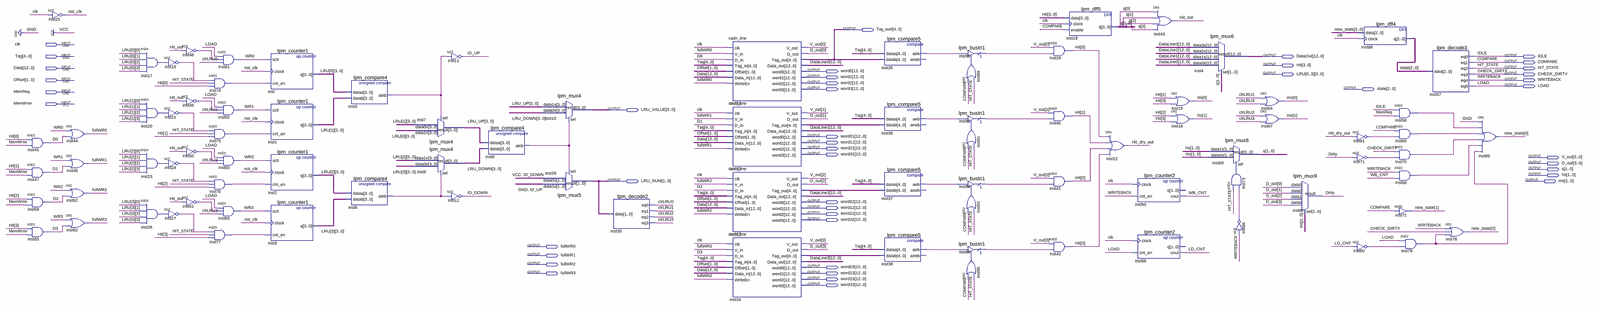
[diagram p0: schematic sheet, whole]
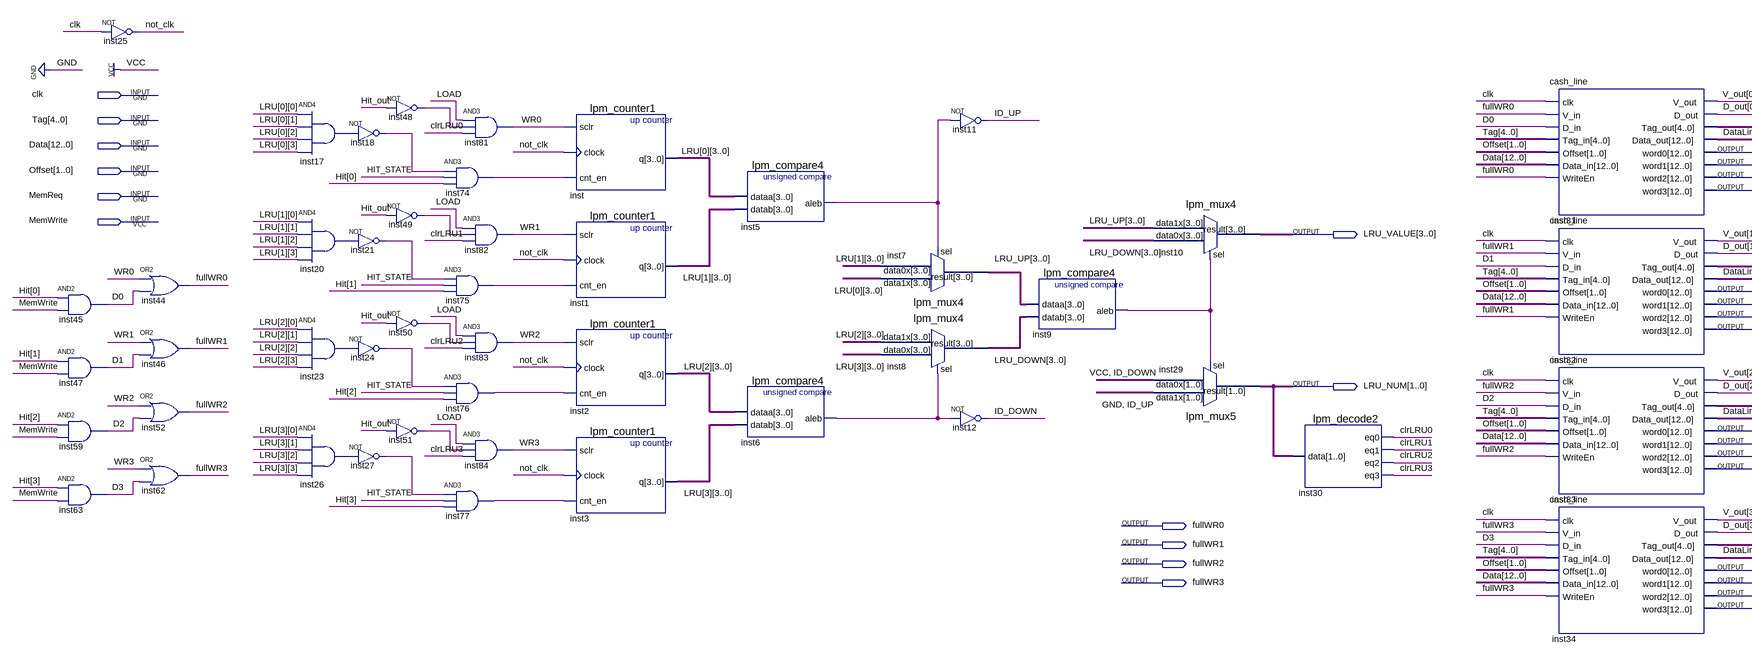
[diagram p1: schematic sheet, left part]
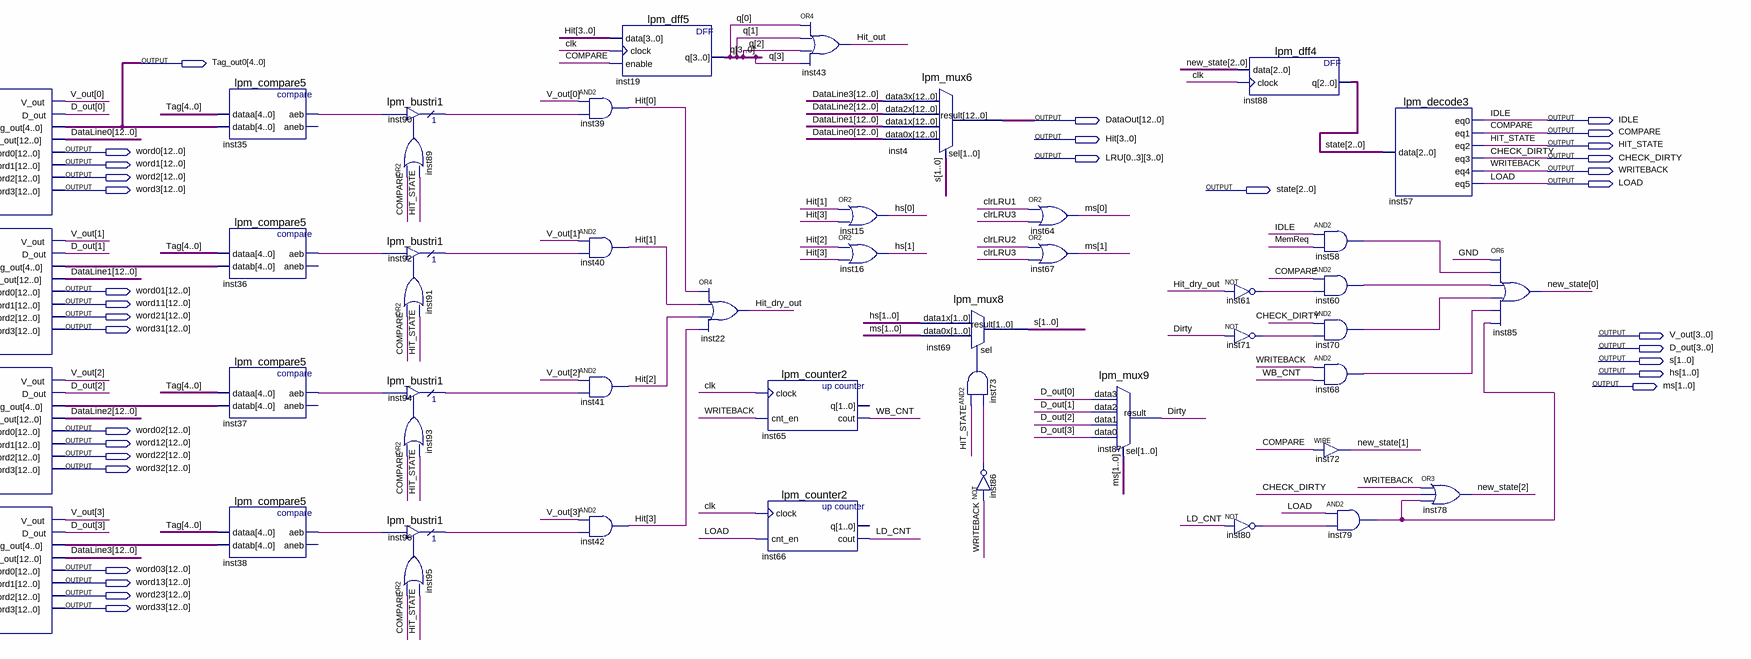
[diagram p2: schematic sheet, right part]
// Quartus schematic LRU_set.bdf as structural Verilog: 90 symbols, 44 pins
module LRU_set (
  input  clk,
  input  [4:0] Tag,
  input  [12:0] Data,
  input  [1:0] Offset,
  input  MemReq,
  input  MemWrite,
  output [4:0] Tag_out0,
  output [12:0] DataOut,
  output IDLE,
  output COMPARE,
  output [3:0] Hit,
  output HIT_STATE,
  output [12:0] word0,
  output [3:0] LRU_0,
  output [3:0] LRU_1,
  output [3:0] LRU_2,
  output [3:0] LRU_3,
  output CHECK_DIRTY,
  output [12:0] word1,
  output WRITEBACK,
  output [12:0] word2,
  output LOAD,
  output [12:0] word3,
  output [2:0] state,
  output [3:0] LRU_VALUE,
  output [12:0] word01,
  output [12:0] word11,
  output [12:0] word21,
  output [12:0] word31,
  output [3:0] V_out,
  output [3:0] D_out,
  output [1:0] s,
  output [1:0] hs,
  output [1:0] LRU_NUM,
  output [1:0] ms,
  output [12:0] word02,
  output [12:0] word12,
  output [12:0] word22,
  output [12:0] word32,
  output fullWR0,
  output fullWR1,
  output fullWR2,
  output [12:0] word03,
  output fullWR3,
  output [12:0] word13,
  output [12:0] word23,
  output [12:0] word33
);

  wire clrLRU0, clrLRU1, clrLRU2, clrLRU3, D0, D1, D2, D3, Dirty, Hit_dry_out, Hit_out, ID_DOWN, ID_UP,
       inst5_aleb, inst6_aleb, inst9_aleb, inst17_out, inst18_out, inst20_out, inst21_out, inst23_out,
       inst24_out, inst26_out, inst27_out, inst35_aeb, inst36_aeb, inst37_aeb, inst38_aeb, inst48_out,
       inst49_out, inst50_out, inst51_out, inst58_out, inst60_out, inst61_out, inst68_out, inst70_out,
       inst71_out, inst73_out, inst74_out, inst75_out, inst76_out, inst77_out, inst79_out, inst80_out,
       inst86_out, inst89_out, inst90_tridata, inst91_out, inst92_tridata, inst93_out, inst94_tridata,
       inst95_out, inst96_tridata, LD_CNT, not_clk, WB_CNT, WR0, WR1, WR2, WR3;
  wire [2:0] new_state;
  wire [3:0] LRU_DOWN, LRU_UP, q;
  wire [4:0] inst32_tag_out, inst33_tag_out, inst34_tag_out;
  wire [12:0] DataLine0, DataLine1, DataLine2, DataLine3;

  and inst45 (D0, Hit[0], MemWrite);
  and inst47 (D1, Hit[1], MemWrite);
  and inst59 (D2, Hit[2], MemWrite);
  and inst63 (D3, Hit[3], MemWrite);
  not inst25 (not_clk, clk);
  or inst44 (fullWR0, WR0, D0);
  or inst46 (fullWR1, WR1, D1);
  or inst52 (fullWR2, WR2, D2);
  or inst62 (fullWR3, WR3, D3);
  and inst17 (inst17_out, LRU_0[0], LRU_0[1], LRU_0[2], LRU_0[3]);
  and inst20 (inst20_out, LRU_1[0], LRU_1[1], LRU_1[2], LRU_1[3]);
  and inst23 (inst23_out, LRU_2[0], LRU_2[1], LRU_2[2], LRU_2[3]);
  and inst26 (inst26_out, LRU_3[0], LRU_3[1], LRU_3[2], LRU_3[3]);
  not inst18 (inst18_out, inst17_out);
  not inst21 (inst21_out, inst20_out);
  not inst24 (inst24_out, inst23_out);
  not inst27 (inst27_out, inst26_out);
  not inst48 (inst48_out, Hit_out);
  not inst49 (inst49_out, Hit_out);
  not inst50 (inst50_out, Hit_out);
  not inst51 (inst51_out, Hit_out);
  and inst81 (WR0, LOAD, inst48_out, clrLRU0);
  and inst74 (inst74_out, inst18_out, HIT_STATE, Hit[0]);
  and inst82 (WR1, LOAD, inst49_out, clrLRU1);
  and inst75 (inst75_out, inst21_out, HIT_STATE, Hit[1]);
  and inst83 (WR2, LOAD, inst50_out, clrLRU2);
  and inst76 (inst76_out, inst24_out, HIT_STATE, Hit[2]);
  and inst84 (WR3, LOAD, inst51_out, clrLRU3);
  and inst77 (inst77_out, inst27_out, HIT_STATE, Hit[3]);
  lpm_counter1 inst (.sclr(WR0), .clock(not_clk), .cnt_en(inst74_out), .q(LRU_0));
  lpm_counter1 inst1 (.sclr(WR1), .clock(not_clk), .cnt_en(inst75_out), .q(LRU_1));
  lpm_counter1 inst2 (.sclr(WR2), .clock(not_clk), .cnt_en(inst76_out), .q(LRU_2));
  lpm_counter1 inst3 (.sclr(WR3), .clock(not_clk), .cnt_en(inst77_out), .q(LRU_3));
  lpm_compare4 inst5 (.dataa(LRU_0), .datab(LRU_1), .aleb(inst5_aleb));
  lpm_compare4 inst6 (.dataa(LRU_2), .datab(LRU_3), .aleb(inst6_aleb));
  lpm_mux4 inst7 (.data1x(LRU_0), .data0x(LRU_1), .sel(inst5_aleb), .result(LRU_UP));
  lpm_mux4 inst8 (.data1x(LRU_2), .data0x(LRU_3), .sel(inst6_aleb), .result(LRU_DOWN));
  not inst11 (ID_UP, inst5_aleb);
  not inst12 (ID_DOWN, inst6_aleb);
  lpm_compare4 inst9 (.dataa(LRU_UP), .datab(LRU_DOWN), .aleb(inst9_aleb));
  lpm_mux4 inst10 (.data1x(LRU_UP), .data0x(LRU_DOWN), .sel(inst9_aleb), .result(LRU_VALUE));
  lpm_mux5 inst29 (.data1x({1'b0, ID_UP}), .data0x({1'b1, ID_DOWN}), .sel(inst9_aleb), .result(LRU_NUM));
  lpm_decode2 inst30 (.data(LRU_NUM), .eq0(clrLRU0), .eq1(clrLRU1), .eq2(clrLRU2), .eq3(clrLRU3));
  cash_line inst31 (
    .clk(clk), .V_in(fullWR0), .D_in(D0), .Tag_in(Tag), .Offset(Offset), .Data_in(Data), .WriteEn(fullWR0),
    .V_out(V_out[0]), .D_out(D_out[0]), .Tag_out(Tag_out0), .Data_out(DataLine0), .word0(word0),
    .word1(word1), .word2(word2), .word3(word3));
  cash_line inst32 (
    .clk(clk), .V_in(fullWR1), .D_in(D1), .Tag_in(Tag), .Offset(Offset), .Data_in(Data), .WriteEn(fullWR1),
    .V_out(V_out[1]), .D_out(D_out[1]), .Tag_out(inst32_tag_out), .Data_out(DataLine1), .word0(word01),
    .word1(word11), .word2(word21), .word3(word31));
  cash_line inst33 (
    .clk(clk), .V_in(fullWR2), .D_in(D2), .Tag_in(Tag), .Offset(Offset), .Data_in(Data), .WriteEn(fullWR2),
    .V_out(V_out[2]), .D_out(D_out[2]), .Tag_out(inst33_tag_out), .Data_out(DataLine2), .word0(word02),
    .word1(word12), .word2(word22), .word3(word32));
  cash_line inst34 (
    .clk(clk), .V_in(fullWR3), .D_in(D3), .Tag_in(Tag), .Offset(Offset), .Data_in(Data), .WriteEn(fullWR3),
    .V_out(V_out[3]), .D_out(D_out[3]), .Tag_out(inst34_tag_out), .Data_out(DataLine3), .word0(word03),
    .word1(word13), .word2(word23), .word3(word33));
  lpm_compare5 inst35 (.dataa(Tag), .datab(Tag_out0), .aeb(inst35_aeb));  // open: aneb
  lpm_compare5 inst36 (.dataa(Tag), .datab(inst32_tag_out), .aeb(inst36_aeb));  // open: aneb
  lpm_compare5 inst37 (.dataa(Tag), .datab(inst33_tag_out), .aeb(inst37_aeb));  // open: aneb
  lpm_compare5 inst38 (.dataa(Tag), .datab(inst34_tag_out), .aeb(inst38_aeb));  // open: aneb
  lpm_bustri1 inst90 (.enabledt(inst89_out), .data(inst35_aeb), .tridata(inst90_tridata));
  or inst89 (inst89_out, COMPARE, HIT_STATE);
  lpm_bustri1 inst92 (.enabledt(inst91_out), .data(inst36_aeb), .tridata(inst92_tridata));
  or inst91 (inst91_out, COMPARE, HIT_STATE);
  lpm_bustri1 inst94 (.enabledt(inst93_out), .data(inst37_aeb), .tridata(inst94_tridata));
  or inst93 (inst93_out, COMPARE, HIT_STATE);
  lpm_bustri1 inst96 (.enabledt(inst95_out), .data(inst38_aeb), .tridata(inst96_tridata));
  or inst95 (inst95_out, COMPARE, HIT_STATE);
  and inst39 (Hit[0], V_out[0], inst90_tridata);
  and inst40 (Hit[1], V_out[1], inst92_tridata);
  and inst41 (Hit[2], V_out[2], inst94_tridata);
  and inst42 (Hit[3], V_out[3], inst96_tridata);
  lpm_dff5 inst19 (.data(Hit), .clock(clk), .enable(COMPARE), .q(q));
  or inst22 (Hit_dry_out, Hit[0], Hit[1], Hit[2], Hit[3]);
  or inst43 (Hit_out, q[0], q[1], q[2], q[3]);
  lpm_counter2 inst65 (.clock(clk), .cnt_en(WRITEBACK), .cout(WB_CNT));  // open: q
  lpm_counter2 inst66 (.clock(clk), .cnt_en(LOAD), .cout(LD_CNT));  // open: q
  or inst15 (hs[0], Hit[1], Hit[3]);
  or inst16 (hs[1], Hit[2], Hit[3]);
  lpm_mux6 inst4 (
    .data3x(DataLine3), .data2x(DataLine2), .data1x(DataLine1), .data0x(DataLine0), .sel(s), .result(DataOut));
  lpm_mux8 inst69 (.data1x(hs), .data0x(ms), .sel(inst73_out), .result(s));
  and inst73 (inst73_out, HIT_STATE, inst86_out);
  not inst86 (inst86_out, WRITEBACK);
  or inst64 (ms[0], clrLRU1, clrLRU3);
  or inst67 (ms[1], clrLRU2, clrLRU3);
  lpm_mux9 inst87 (.data3(D_out[0]), .data2(D_out[1]), .data1(D_out[2]), .data0(D_out[3]), .sel(ms), .result(Dirty));
  lpm_dff4 inst88 (.data(new_state), .clock(clk), .q(state));
  not inst61 (inst61_out, Hit_dry_out);
  not inst71 (inst71_out, Dirty);
  not inst80 (inst80_out, LD_CNT);
  and inst58 (inst58_out, IDLE, MemReq);
  and inst60 (inst60_out, COMPARE, inst61_out);
  and inst70 (inst70_out, CHECK_DIRTY, inst71_out);
  and inst68 (inst68_out, WRITEBACK, WB_CNT);
  assign new_state[1] = COMPARE;  // WIRE inst72
  and inst79 (inst79_out, LOAD, inst80_out);
  lpm_decode3 inst57 (
    .data(state), .eq0(IDLE), .eq1(COMPARE), .eq2(HIT_STATE), .eq3(CHECK_DIRTY), .eq4(WRITEBACK), .eq5(LOAD));
  or inst78 (new_state[2], WRITEBACK, CHECK_DIRTY, inst79_out);
  or inst85 (new_state[0], 1'b0, inst58_out, inst60_out, inst70_out, inst68_out, inst79_out);
endmodule
